# EAGLE design Moteino-Pi-Gateway (EAGLE 7.2.0)
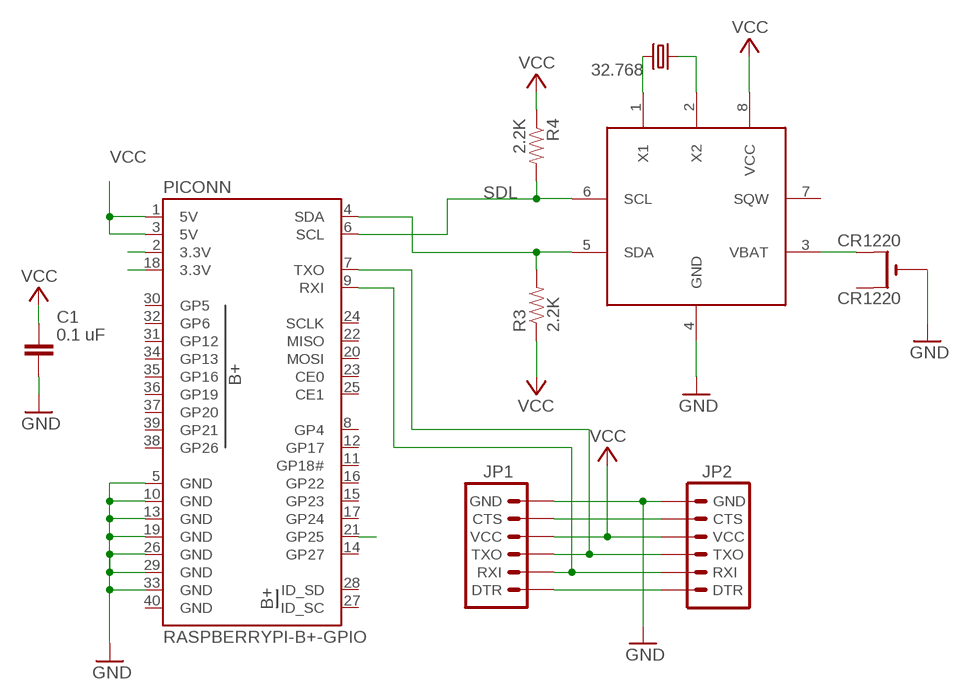
[diagram p0: schematic, sheet 1]

## Parts
32.768  CRYTALTC38H  [TC38H]
1307  DS1307  [SO8]
C1  0.1 uF  CAPACITOR_NPOL-1206  [C1206]
CR1220  CR1220  CR1220THM  [CR1220-THM]
JP1  ARDUINO_SERIAL_PROGRAMLOCK  [1X06_LOCK]
JP2  ARDUINO_SERIAL_PROGRAMLOCK  [1X06_LOCK]
PICONN  RASPBERRYPI-B+-GPIO  [2X20-SHROUDED]
R3  2.2K  RESISTOR0805-RES  [0805]
R4  2.2K  RESISTOR0805-RES  [0805]

## Nets
3.3V: PICONN.2(3.3V)
3.3V2: PICONN.18(3.3V)
GND: 1307.4(GND) C1.2 CR1220.- JP1.6(GND) JP2.6(GND) PICONN.5(GND) PICONN.10(GND) PICONN.13(GND) PICONN.19(GND) PICONN.26(GND) PICONN.29(GND) PICONN.33(GND)
N$1: 1307.3(VBAT) CR1220.+2(+1)
N$2: 32.768.2 1307.1(X1)
N$3: 32.768.1 1307.2(X2)
N$4: JP1.2(RXI) JP2.2(RXI) PICONN.9(RXI)
N$5: JP1.3(TXO) JP2.3(TXO) PICONN.7(TXO)
N$7: JP1.5(CTS) JP2.5(CTS)
N$11: PICONN.21(GP25)
N$14: JP1.1(DTR) JP2.1(DTR)
SDA: 1307.5(SDA) PICONN.4(SDA) R3.2
SDL: 1307.6(SCL) PICONN.6(SCL) R4.2
VCC: 1307.8(VCC) C1.1 JP1.4(VCC) JP2.4(VCC) PICONN.1(5V) PICONN.3(5V) R3.1 R4.1
Unconnected: 1307.7(SQW) CR1220.+1(+) PICONN.8(GP4) PICONN.11(GP18#) PICONN.12(GP17) PICONN.14(GP27) PICONN.15(GP23) PICONN.16(GP22) PICONN.17(GP24) PICONN.20(MOSI) PICONN.22(MISO) PICONN.23(CE0) PICONN.24(SCLK) PICONN.25(CE1) PICONN.27(ID_SC) PICONN.28(ID_SD) PICONN.30(GP5) PICONN.31(GP12) PICONN.32(GP6) PICONN.34(GP13) PICONN.35(GP16) PICONN.36(GP19) PICONN.37(GP20) PICONN.38(GP26) PICONN.39(GP21)

## Power pins joined to a net without a drawn wire
GND: PICONN.40(GND)

## Library data of the parts
32.768 = crystal:CRYTAL: CRYSTAL
1307 = PlantAware:DS1307
C1 = dp_devices:CAPACITOR_NPOL: Non-Polarized capacitor in various packages
CR1220 = adafruit:CR1220: CR1216/CR1220/CR1225 12mm 3V lithium coin cell Great for battery packup. Both SMT and THM holders. Note the THM package has the ground pads on both sides of the PCB so that the masks are the same - this reduces the cost
JP1 JP2 = SparkFun-Connectors:ARDUINO_SERIAL_PROGRAM: FTDI connector footprints
PICONN = SparkFun-Boards:RASPBERRYPI-B+-GPIO: Raspberry Pi B+ GPIO Header 2x20 pin connector
R3 R4 = SparkFun-Passives:RESISTOR: Resistor Basic schematic elements and footprints for 0603, 1206, and PTH resistors.

## Board
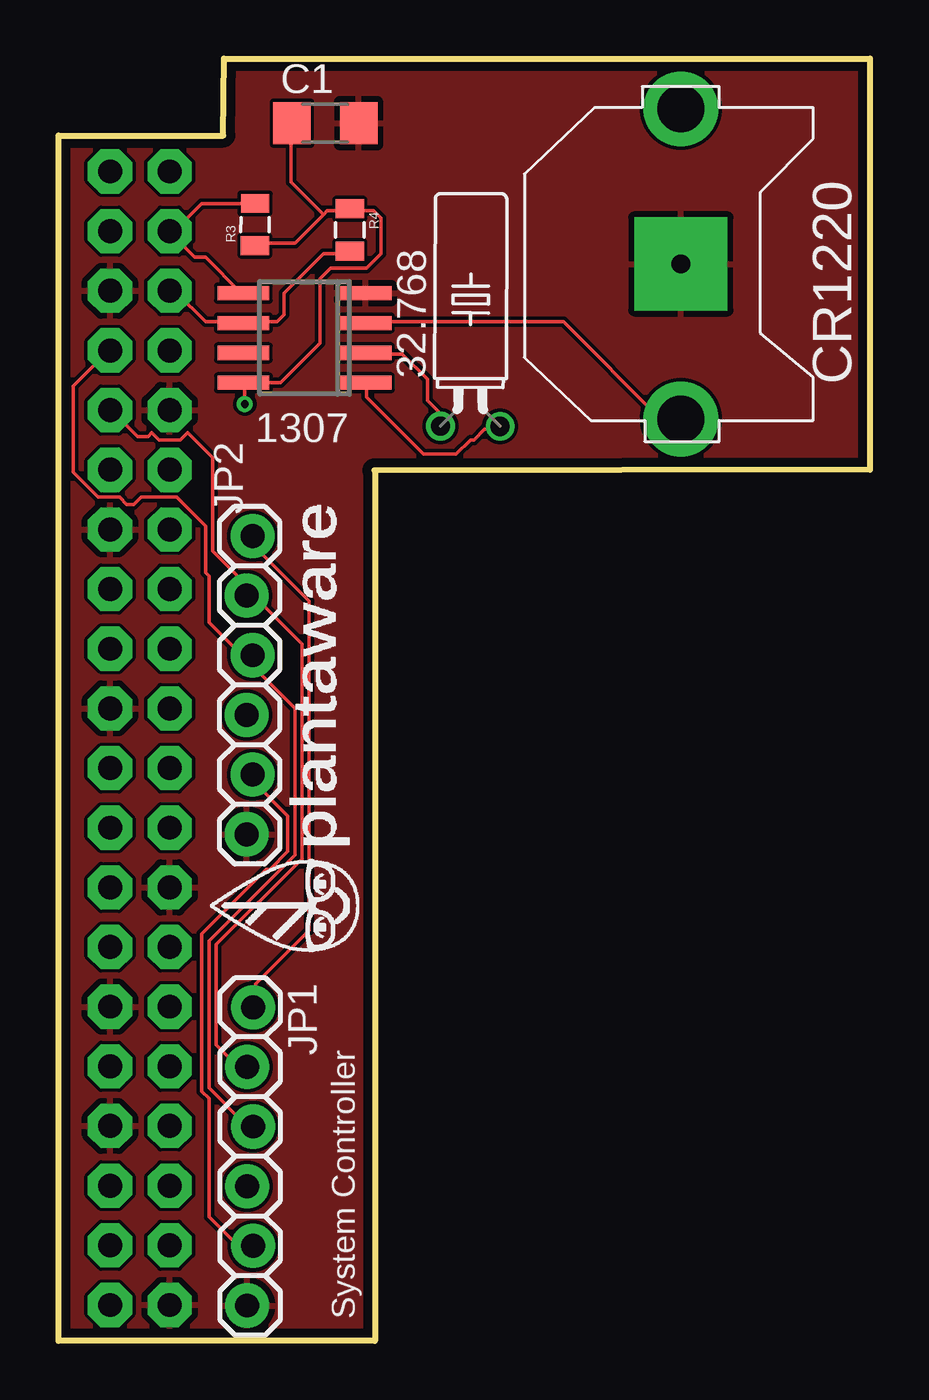
[diagram p1: board, top side]
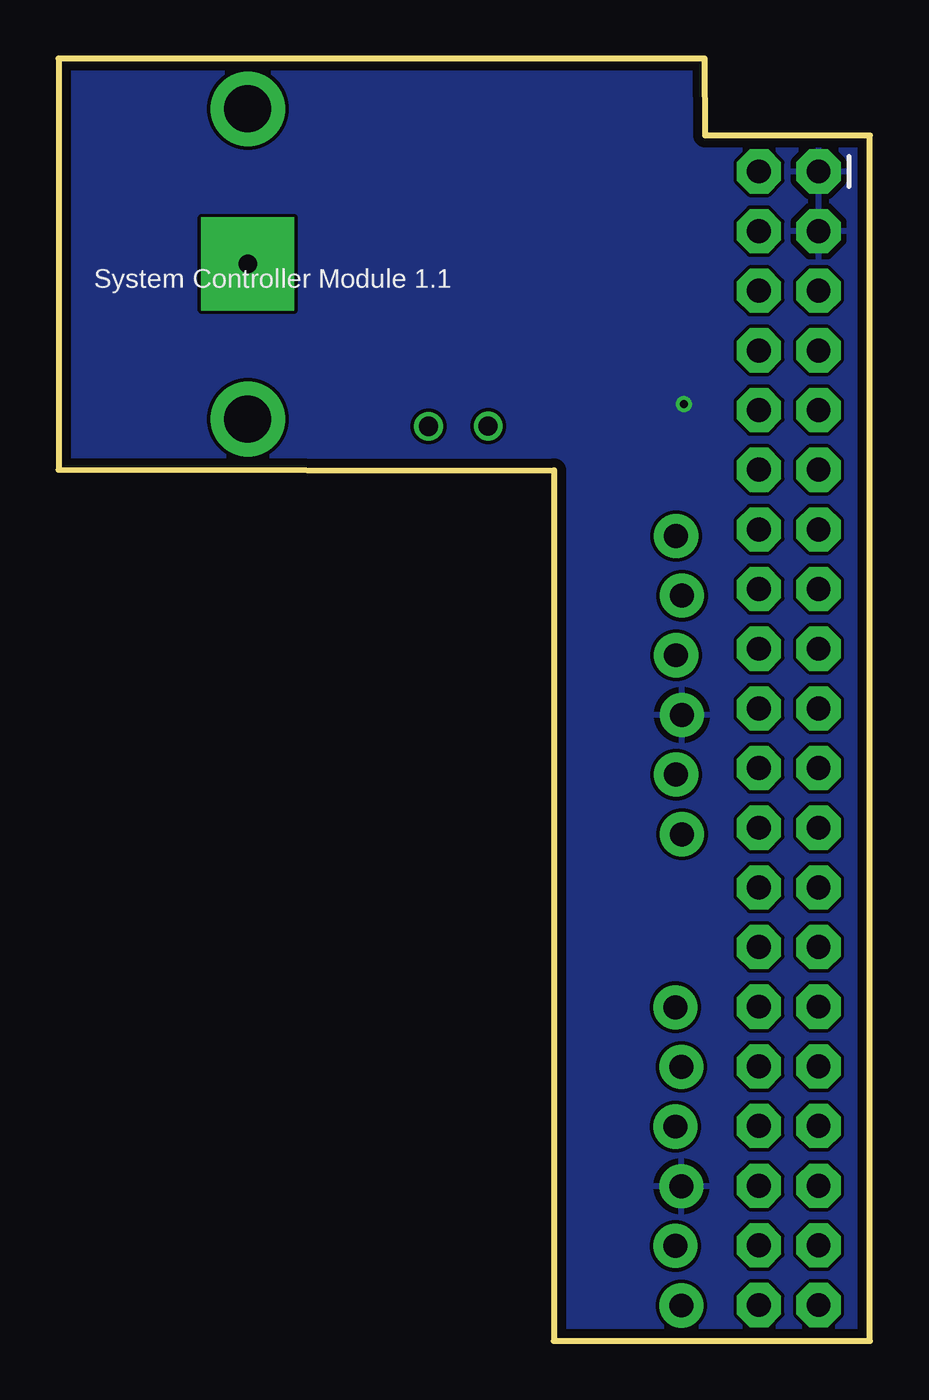
[diagram p2: board, bottom side, seen from below]

Size 34.54 x 54.58 mm. Coordinates in mm from the lower left corner, seen from the top.
Outline: 13.44,37.06 34.54,37.08 34.54,54.58 7.04,54.58 7.01,51.31 0,51.31 0,0 13.46,0 13.46,37.06
Copper layers (1*16): Top 0.0356mm / dielectric 1.5011mm / Bottom 0.0356mm
Design rules "LaenPCBOrder": minimum track width 6mil, minimum drill 13mil, track to track 6mil, track to pad 6mil, pad to pad 6mil, via to via 6mil, smd to smd 6mil, copper to edge 15mil, drill to drill 6mil, minimum pad ring 7mil, minimum via ring 7mil, stop-mask expansion 4mil, vias tented up to drill 0mil, thermal gap 10mil

### Footprints (pad centres in the part's own frame; a part is rotated, then mirrored left to right if it is on the bottom)
TC38H = drill 0.813: 1 -1.27,0; 2 1.27,0
SO8 = smd 0.6 x 2.2: 1 -1.905,-2.6; 2 -0.635,-2.6; 3 0.635,-2.6; 4 1.905,-2.6; 5 1.905,2.6; 6 0.635,2.6; 7 -0.635,2.6; 8 -1.905,2.6
C1206 = smd 1.6 x 1.803: 1 -1.422,0; 2 1.422,0
CR1220-THM = drill 2 pad 3.175: +1 -6.604,0; +2 6.604,0 | drill 0.8 pad 3.962 square: - 0,0
1X06_LOCK = drill 1.016 pad 1.88: 1 0,0; 2 2.54,-0.254; 3 5.08,0; 4 7.62,-0.254; 5 10.16,0; 6 12.7,-0.254
2X20-SHROUDED = drill 1.016 pad 1.88 octagon: 1 1.27,24.13; 2 -1.27,24.13; 3 1.27,21.59; 4 -1.27,21.59; 5 1.27,19.05; 6 -1.27,19.05; 7 1.27,16.51; 8 -1.27,16.51; 9 1.27,13.97; 10 -1.27,13.97; 11 1.27,11.43; 12 -1.27,11.43; 13 1.27,8.89; 14 -1.27,8.89; 15 1.27,6.35; 16 -1.27,6.35; 17 1.27,3.81; 18 -1.27,3.81; 19 1.27,1.27; 20 -1.27,1.27; 21 1.27,-1.27; 22 -1.27,-1.27; 23 1.27,-3.81; 24 -1.27,-3.81; 25 1.27,-6.35; 26 -1.27,-6.35; 27 1.27,-8.89; 28 -1.27,-8.89; 29 1.27,-11.43; 30 -1.27,-11.43; 31 1.27,-13.97; 32 -1.27,-13.97; 33 1.27,-16.51; 34 -1.27,-16.51; 35 1.27,-19.05; 36 -1.27,-19.05; 37 1.27,-21.59; 38 -1.27,-21.59; 39 1.27,-24.13; 40 -1.27,-24.13
0805 = smd 0.8 x 1.2: 1 -0.9,0; 2 0.9,0

### Placement (x,y rotation side)
32.768  17.53,38.94 359.8 top
1307  10.46,42.7 90 top
C1  11.35,51.84 0 top
CR1220  26.49,45.85 270 top
JP1  8.28,14.2 270 top
JP2  8.25,34.26 270 top
PICONN  3.45,25.65 0 bottom
R3  8.36,47.52 89.8 top
R4  12.4,47.29 270 top
U$1  [LOGO_08_INCH]  12.95,15.98 90 top

### Tracks (layer width: path | path; a pad name or v marks a point on that pad's centre or on a via)
GND
  pour Top: -3.91,-7.11 -2.9,56.9 52.68,56.87 52.43,-7.65
N$1
  Top 0.152: 1307.3 13.11,43.38 21.49,43.38 25.6,39.27 26.37,39.27 CR1220.+2
N$2
  Top 0.152: 1307.1 13.11,40.79 13.11,40.18 15.54,37.74 16.92,37.74 17.53,38.35 17.68,38.35 18.14,38.81 18.75,38.81 32.768.2
N$3
  Top 0.152: 1307.2 13.11,42.01 14.63,42.01 15.7,40.95 15.7,40.03 16.15,39.57 16.15,38.96 32.768.1
N$4
  Top 0.152: JP1.2 7.92,11.68 7.62,11.68 6.71,12.6 6.71,16.87 10.36,20.52 10.36,29.67 8.38,31.65 8.08,31.65 JP2.2 7.92,31.8 7.92,32.26 6.55,33.63 6.55,37.59 5.49,38.66 5.18,38.35 4.27,38.35 3.96,38.66 3.81,38.51 3.35,38.51 2.29,39.57 PICONN.9
N$5
  Top 0.152: JP1.3 8.23,9.25 7.92,9.25 6.4,10.77 6.4,17.02 10.06,20.68 10.06,26.92 8.38,28.6 8.38,29.06 JP2.3 8.23,29.21 7.77,29.21 6.4,30.58 6.4,32.56 6.25,32.71 6.25,34.7 5.03,35.92 3.51,35.92 3.2,35.61 2.9,35.61 2.59,35.92 1.68,35.92 0.61,36.98 0.61,40.64 2.13,42.16 PICONN.7
N$7
  Top 0.152: JP1.5 8.23,4.06 7.62,4.06 6.4,5.28 6.4,10.31 6.1,10.62 6.1,17.32 8.84,20.07 8.99,20.07 9.75,20.83 9.75,22.35 8.38,23.72 8.38,24.03 JP2.5
N$14
  Top 0.152: JP1.1 8.38,14.28 8.38,15.19 10.67,17.48 10.67,31.5 8.38,33.78 8.38,34.24 JP2.1
SDA
  Top 0.152: R3.2 8.23,48.41 6.1,48.41 5.03,47.35 4.72,47.35 PICONN.4 4.72,47.19 5.79,46.13 6.25,46.13 7.77,44.6 1307.5
SDL
  Top 0.152: R4.2 12.34,46.28 11.28,46.28 9.6,44.6 9.6,43.69 9.3,43.38 7.92,43.38 1307.6 7.77,43.38 6.25,43.38 5.03,44.6 4.72,44.6 PICONN.6
VCC  (via drill 0.33)
  Top 0.152: v7.92,39.88 7.92,40.79 | 11.28,47.95 11.43,48.11 12.34,48.11 R4.1 12.5,48.11 13.41,48.11 13.72,47.8 13.72,46.28 13.11,45.67 11.58,45.67 11.13,45.21 11.13,42.47 9.45,40.79 7.92,40.79 | 11.28,47.95 10.06,46.74 8.38,46.74 R3.1 | 11.28,47.95 9.91,49.33 9.91,51.77 C1.1 | 7.92,40.79 1307.8
  pour Bottom: -2.64,56.64 52.6,56.82 51.08,-8.46 34.95,-8.89 -4.09,-7.14

### Text on the board
bPlace: System Controller Module 1.1
tNames: System Controller